# Altium schematic sheet HTBLEBMSALLPro1_4G&AB_Sch_V0.1_260316.SchDoc
size A3; SheetNumber: 2; SheetTotal: 2
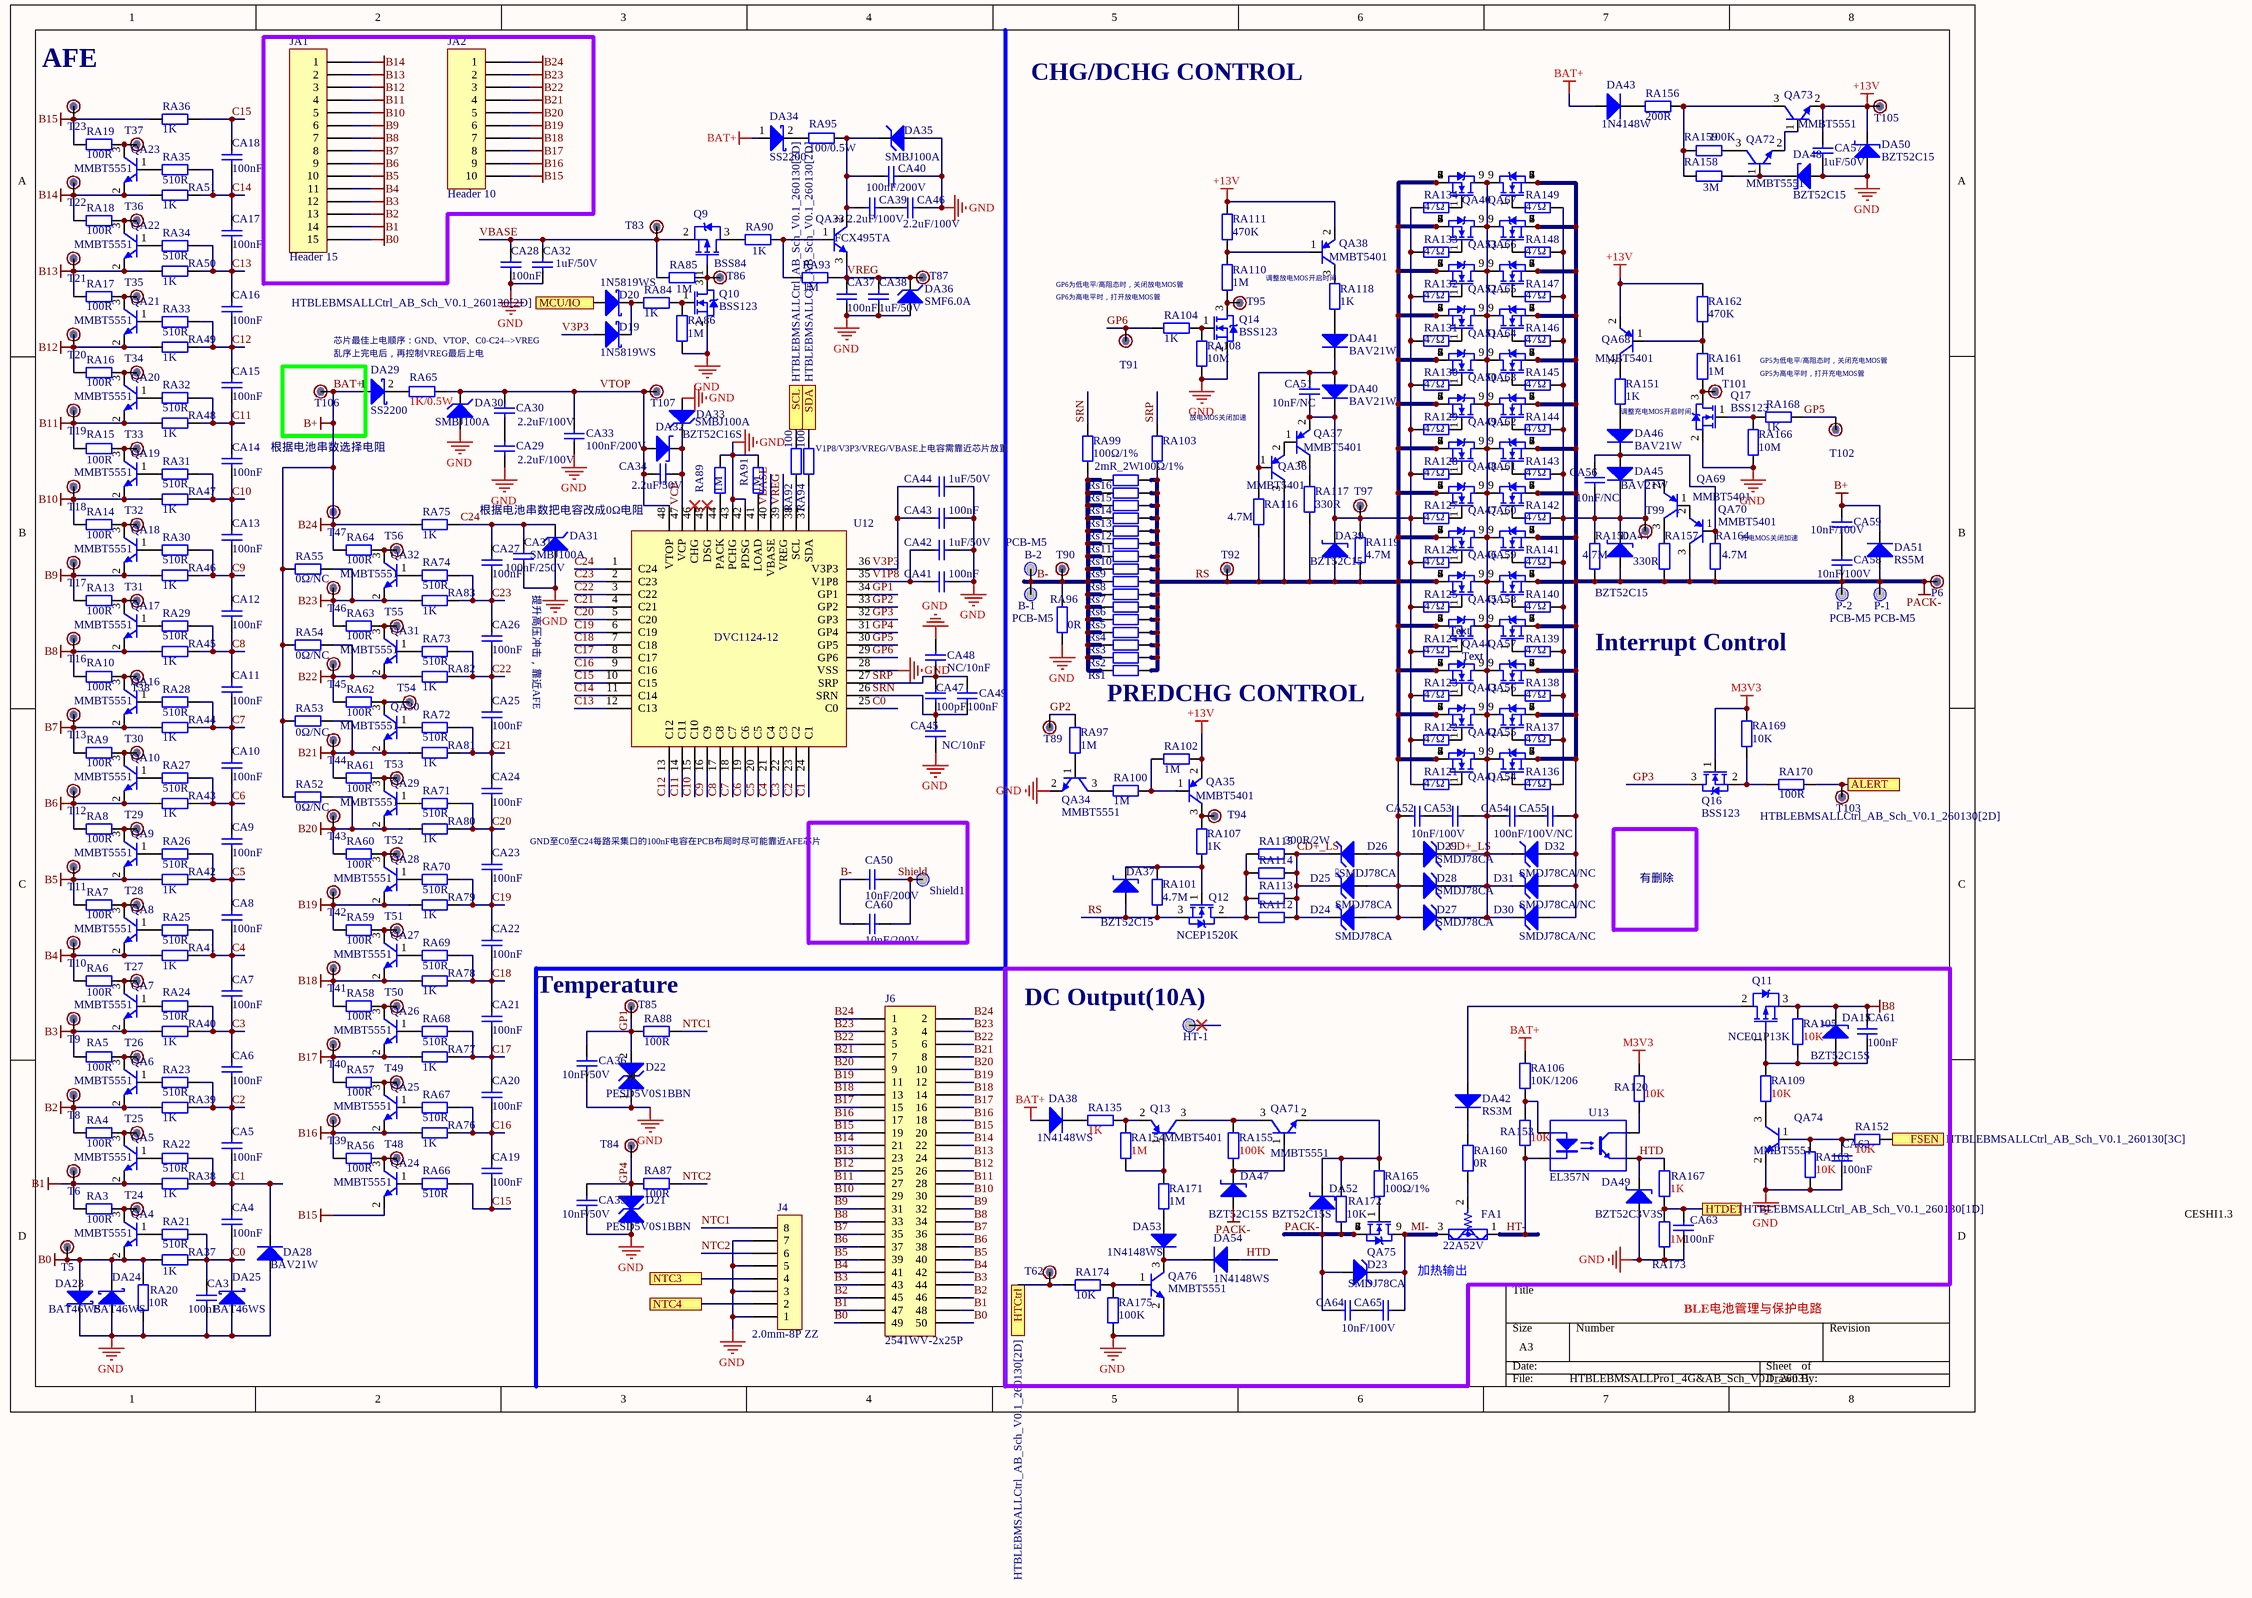
[diagram p0: HTBLEBMSALLPro1_4G&AB_Sch_V0.1_260316.SchDoc]

## Parts
B-1  PCB-M5  [PCB-177M5]
B-2  PCB-M5  [PCB-177M5]
CA3  100nF  [C0603]
CA4  100nF  [C0603]
CA5  100nF  [C0603]
CA6  100nF  [C0603]
CA7  100nF  [C0603]
CA8  100nF  [C0603]
CA9  100nF  [C0603]
CA10  100nF  [C0603]
CA11  100nF  [C0603]
CA12  100nF  [C0603]
CA13  100nF  [C0603]
CA14  100nF  [C0603]
CA15  100nF  [C0603]
CA16  100nF  [C0603]
CA17  100nF  [C0603]
CA18  100nF  [C0603]
CA19  100nF  [C0603]
CA20  100nF  [C0603]
CA21  100nF  [C0603]
CA22  100nF  [C0603]
CA23  100nF  [C0603]
CA24  100nF  [C0603]
CA25  100nF  [C0603]
CA26  100nF  [C0603]
CA27  100nF  [C0603]
CA28  100nF  [C0603]
CA29  2.2uF/100V  [C1206]
CA30  2.2uF/100V  [C1206]
CA31  100nF/250V  [C1206]
CA32  1uF/50V  [C0603]
CA33  100nF/200V  [C0805]
CA34  2.2uF/50V  [C0805]
CA35  10nF/50V  [C0603]
CA36  10nF/50V  [C0603]
CA37  100nF  [C0603]
CA38  1uF/50V  [C0603]
CA39  2.2uF/100V  [C1206]
CA40  100nF/200V  [C0805]
CA41  100nF  [C0603]
CA42  1uF/50V  [C0603]
CA43  100nF  [C0603]
CA44  1uF/50V  [C0603]
CA45  NC/10nF  [C0603]
CA46  2.2uF/100V  [C1206]
CA47  100pF  [C0603]
CA48  NC/10nF  [C0603]
CA49  100nF  [C0603]
CA50  10nF/200V  [C0805]
CA51  10nF/NC  [C0603]
CA52  10nF/100V  [C0805]
CA53  10nF/100V  [C0805]  (value not drawn)
CA54  100nF/100V/NC  [C0805]
CA55  100nF/100V/NC  [C0805]  (value not drawn)
CA56  10nF/NC  [C0603]
CA57  1uF/50V  [C0603]
CA58  10nF/100V  [C1206]
CA59  10nF/100V  [C1206]
CA60  10nF/200V  [C0805]
CA61  100nF  [C0603]
CA62  100nF  [C0603]
CA63  100nF  [C0603]
CA64  10nF/100V  [C0805]
CA65  10nF/100V  [C0805]  (value not drawn)
D19  1N5819WS  [SOD-323]
D20  1N5819WS  [SOD-323]
D21  PESD5V0S1BBN  [SOD-523]
D22  PESD5V0S1BBN  [SOD-523]
D23  SMDJ78CA  [SMC/DO-214AB]
D24  SMDJ78CA  [SMC/DO-214AB]
D25  SMDJ78CA  [SMC/DO-214AB]
D26  SMDJ78CA  [SMC/DO-214AB]
D27  SMDJ78CA  [SMC/DO-214AB]
D28  SMDJ78CA  [SMC/DO-214AB]
D29  SMDJ78CA  [SMC/DO-214AB]
D30  SMDJ78CA/NC  [SMC/DO-214AB]
D31  SMDJ78CA/NC  [SMC/DO-214AB]
D32  SMDJ78CA/NC  [SMC/DO-214AB]
DA15  BZT52C15S  [SOD-323]
DA23  BAT46WS  [SOD-323]
DA24  BAT46WS  [SOD-323]
DA25  BAT46WS  [SOD-323]
DA28  BAV21W  [SOD-123]
DA29  SS2200  [SMA/DO-214AC]
DA30  SMBJ100A  [SMB/DO-214AA]
DA31  SMBJ100A  [SMB/DO-214AA]
DA32  BZT52C16S  [SOD-323]
DA33  SMBJ100A  [SMB/DO-214AA]
DA34  SS2200  [SMA/DO-214AC]
DA35  SMBJ100A  [SMB/DO-214AA]
DA36  SMF6.0A  [SOD-123]
DA37  BZT52C15  [SOD-123]
DA38  1N4148WS  [SOD-323]
DA39  BZT52C15  [SOD-123]
DA40  BAV21W  [SOD-123]
DA41  BAV21W  [SOD-123]
DA42  RS3M  [SMB/DO-214AA]
DA43  1N4148W  [SOD-123]
DA44  BZT52C15  [SOD-123]
DA45  BAV21W  [SOD-123]
DA46  BAV21W  [SOD-123]
DA47  BZT52C15S  [SOD-323]
DA48  BZT52C15  [SOD-123]
DA49  BZT52C3V3S  [SOD-323]
DA50  BZT52C15  [SOD-123]
DA51  RS5M  [SMB/DO-214AA]
DA52  BZT52C15S  [SOD-323]
DA53  1N4148WS  [SOD-323]
DA54  1N4148WS  [SOD-323]
FA1  22A52V  [22A52V]
HT-1  PCB-1004  [BAT+]  (value not drawn)
J4  2.0mm-8P ZZ  [PH2.0-WI-8P]
J6  2541WV-2x25P  [CON-TH_2X21P-P2.00-V-F-R2]
JA1  Header 15  [PH2.0-WI-15P]
JA2  Header 10  [PH2.0-WI-10P]
P6  copper  [COPPER1]  (value not drawn)
P-1  PCB-M5  [PCB-177M5]
P-2  PCB-M5  [PCB-177M5]
Q9  BSS84  [SOT23]
Q10  BSS123  [SOT23]
Q11  NCE01P13K  [TO-252]
Q12  NCEP1520K  [TO-252]
Q13  MMBT5401  [SOT23]
Q14  BSS123  [SOT23]
Q16  BSS123  [SOT23]
Q17  BSS123  [SOT23]
QA4  MMBT5551  [SOT23]
QA5  MMBT5551  [SOT23]
QA6  MMBT5551  [SOT23]
QA7  MMBT5551  [SOT23]
QA8  MMBT5551  [SOT23]
QA9  MMBT5551  [SOT23]
QA10  MMBT5551  [SOT23]
QA16  MMBT5551  [SOT23]
QA17  MMBT5551  [SOT23]
QA18  MMBT5551  [SOT23]
QA19  MMBT5551  [SOT23]
QA20  MMBT5551  [SOT23]
QA21  MMBT5551  [SOT23]
QA22  MMBT5551  [SOT23]
QA23  MMBT5551  [SOT23]
QA24  MMBT5551  [SOT23]
QA25  MMBT5551  [SOT23]
QA26  MMBT5551  [SOT23]
QA27  MMBT5551  [SOT23]
QA28  MMBT5551  [SOT23]
QA29  MMBT5551  [SOT23]
QA30  MMBT5551  [SOT23]
QA31  MMBT5551  [SOT23]
QA32  MMBT5551  [SOT23]
QA33  FCX495TA  [SOT89]
QA34  MMBT5551  [SOT23]
QA35  MMBT5401  [SOT23]
QA36  MMBT5401  [SOT23]
QA37  MMBT5401  [SOT23]
QA38  MMBT5401  [SOT23]
QA40  LR038N15S10  [TOLL-8_L10.4-W9.9-P1.20-LS11.7-BL]  (value not drawn)
QA41  LR038N15S10  [TOLL-8_L10.4-W9.9-P1.20-LS11.7-BL]  (value not drawn)
QA42  LR038N15S10  [TOLL-8_L10.4-W9.9-P1.20-LS11.7-BL]  (value not drawn)
QA43  LR038N15S10  [TOLL-8_L10.4-W9.9-P1.20-LS11.7-BL]  (value not drawn)
QA44  LR038N15S10  [TOLL-8_L10.4-W9.9-P1.20-LS11.7-BL]  (value not drawn)
QA45  LR038N15S10  [TOLL-8_L10.4-W9.9-P1.20-LS11.7-BL]  (value not drawn)
QA46  LR038N15S10  [TOLL-8_L10.4-W9.9-P1.20-LS11.7-BL]  (value not drawn)
QA47  LR038N15S10  [TOLL-8_L10.4-W9.9-P1.20-LS11.7-BL]  (value not drawn)
QA48  LR038N15S10  [TOLL-8_L10.4-W9.9-P1.20-LS11.7-BL]  (value not drawn)
QA49  LR038N15S10  [TOLL-8_L10.4-W9.9-P1.20-LS11.7-BL]  (value not drawn)
QA50  LR038N15S10  [TOLL-8_L10.4-W9.9-P1.20-LS11.7-BL]  (value not drawn)
QA51  LR038N15S10  [TOLL-8_L10.4-W9.9-P1.20-LS11.7-BL]  (value not drawn)
QA52  LR038N15S10  [TOLL-8_L10.4-W9.9-P1.20-LS11.7-BL]  (value not drawn)
QA53  LR038N15S10  [TOLL-8_L10.4-W9.9-P1.20-LS11.7-BL]  (value not drawn)
QA54  LR038N15S10  [TOLL-8_L10.4-W9.9-P1.20-LS11.7-BL]  (value not drawn)
QA55  LR038N15S10  [TOLL-8_L10.4-W9.9-P1.20-LS11.7-BL]  (value not drawn)
QA56  LR038N15S10  [TOLL-8_L10.4-W9.9-P1.20-LS11.7-BL]  (value not drawn)
QA57  LR038N15S10  [TOLL-8_L10.4-W9.9-P1.20-LS11.7-BL]  (value not drawn)
QA58  LR038N15S10  [TOLL-8_L10.4-W9.9-P1.20-LS11.7-BL]  (value not drawn)
QA59  LR038N15S10  [TOLL-8_L10.4-W9.9-P1.20-LS11.7-BL]  (value not drawn)
QA60  LR038N15S10  [TOLL-8_L10.4-W9.9-P1.20-LS11.7-BL]  (value not drawn)
QA61  LR038N15S10  [TOLL-8_L10.4-W9.9-P1.20-LS11.7-BL]  (value not drawn)
QA62  LR038N15S10  [TOLL-8_L10.4-W9.9-P1.20-LS11.7-BL]  (value not drawn)
QA63  LR038N15S10  [TOLL-8_L10.4-W9.9-P1.20-LS11.7-BL]  (value not drawn)
QA64  LR038N15S10  [TOLL-8_L10.4-W9.9-P1.20-LS11.7-BL]  (value not drawn)
QA65  LR038N15S10  [TOLL-8_L10.4-W9.9-P1.20-LS11.7-BL]  (value not drawn)
QA66  LR038N15S10  [TOLL-8_L10.4-W9.9-P1.20-LS11.7-BL]  (value not drawn)
QA67  LR038N15S10  [TOLL-8_L10.4-W9.9-P1.20-LS11.7-BL]  (value not drawn)
QA68  MMBT5401  [SOT23]
QA69  MMBT5401  [SOT23]
QA70  MMBT5401  [SOT23]
QA71  MMBT5551  [SOT23]
QA72  MMBT5551  [SOT23]
QA73  MMBT5551  [SOT23]
QA74  MMBT5551  [SOT23]
QA75  KCX017N10N  [TOLL-8_L10.4-W9.9-P1.20-LS11.7-BL]  (value not drawn)
QA76  MMBT5551  [SOT23]
RA3  100R  [1206]
RA4  100R  [1206]
RA5  100R  [1206]
RA6  100R  [1206]
RA7  100R  [1206]
RA8  100R  [1206]
RA9  100R  [1206]
RA10  100R  [1206]
RA13  100R  [1206]
RA14  100R  [1206]
RA15  100R  [1206]
RA16  100R  [1206]
RA17  100R  [1206]
RA18  100R  [1206]
RA19  100R  [1206]
RA20  10R  [1206]
RA21  510R  [0603]
RA22  510R  [0603]
RA23  510R  [0603]
RA24  510R  [0603]
RA25  510R  [0603]
RA26  510R  [0603]
RA27  510R  [0603]
RA28  510R  [0603]
RA29  510R  [0603]
RA30  510R  [0603]
RA31  510R  [0603]
RA32  510R  [0603]
RA33  510R  [0603]
RA34  510R  [0603]
RA35  510R  [0603]
RA36  1K  [0603]
RA37  1K  [0603]
RA38  1K  [0603]
RA39  1K  [0603]
RA40  1K  [0603]
RA41  1K  [0603]
RA42  1K  [0603]
RA43  1K  [0603]
RA44  1K  [0603]
RA45  1K  [0603]
RA46  1K  [0603]
RA47  1K  [0603]
RA48  1K  [0603]
RA49  1K  [0603]
RA50  1K  [0603]
RA51  1K  [0603]
RA52  0Ω/NC  [0805]
RA53  0Ω/NC  [0805]
RA54  0Ω/NC  [0805]
RA55  0Ω/NC  [0805]
RA56  100R  [1206]
RA57  100R  [1206]
RA58  100R  [1206]
RA59  100R  [1206]
RA60  100R  [1206]
RA61  100R  [1206]
RA62  100R  [1206]
RA63  100R  [1206]
RA64  100R  [1206]
RA65  1K/0.5W  [1210R]
RA66  510R  [0603]
RA67  510R  [0603]
RA68  510R  [0603]
RA69  510R  [0603]
RA70  510R  [0603]
RA71  510R  [0603]
RA72  510R  [0603]
RA73  510R  [0603]
RA74  510R  [0603]
RA75  1K  [0603]
RA76  1K  [0603]
RA77  1K  [0603]
RA78  1K  [0603]
RA79  1K  [0603]
RA80  1K  [0603]
RA81  1K  [0603]
RA82  1K  [0603]
RA83  1K  [0603]
RA84  1K  [0603]
RA85  1M  [0603]
RA86  1M  [0603]
RA87  100R  [0603]
RA88  100R  [0603]
RA89  1M  [0603]
RA90  1K  [0603]
RA91  1M  [0603]
RA92  100  [0603]
RA93  1M  [0603]
RA94  100  [0603]
RA95  100/0.5W  [1210R]
RA96  0R  [1206]
RA97  1M  [0603]
RA99  100Ω/1%  [0603]
RA100  1M  [0603]
RA101  4.7M  [0603]
RA102  1M  [0603]
RA103  100Ω/1%  [0603]
RA104  1K  [0603]
RA105  10K  [0603]
RA106  10K/1206  [1206]
RA107  1K  [0603]
RA108  10M  [0603]
RA109  10K  [0603]
RA110  1M  [0603]
RA111  470K  [0603]
RA112  300R/2W  [2512]  (value not drawn)
RA113  300R/2W  [2512]  (value not drawn)
RA114  300R/2W  [2512]  (value not drawn)
RA115  300R/2W  [2512]
RA116  4.7M  [0603]
RA117  330R  [0603]
RA118  1K  [0603]
RA119  4.7M  [0603]
RA120  10K  [0603]
RA121  47Ω  [0603]
RA122  47Ω  [0603]
RA123  47Ω  [0603]
RA124  47Ω  [0603]
RA125  47Ω  [0603]
RA126  47Ω  [0603]
RA127  47Ω  [0603]
RA128  47Ω  [0603]
RA129  47Ω  [0603]
RA130  47Ω  [0603]
RA131  47Ω  [0603]
RA132  47Ω  [0603]
RA133  47Ω  [0603]
RA134  47Ω  [0603]
RA135  1K  [0603]
RA136  47Ω  [0603]
RA137  47Ω  [0603]
RA138  47Ω  [0603]
RA139  47Ω  [0603]
RA140  47Ω  [0603]
RA141  47Ω  [0603]
RA142  47Ω  [0603]
RA143  47Ω  [0603]
RA144  47Ω  [0603]
RA145  47Ω  [0603]
RA146  47Ω  [0603]
RA147  47Ω  [0603]
RA148  47Ω  [0603]
RA149  47Ω  [0603]
RA150  4.7M  [0603]
RA151  1K  [0603]
RA152  10K  [0603]
RA153  10K  [0603]
RA154  1M  [0603]
RA155  100K  [0603]
RA156  200R  [0805]
RA157  330R  [0603]
RA158  3M  [0603]
RA159  100K  [0603]
RA160  0R  [1206]
RA161  1M  [0603]
RA162  470K  [0603]
RA163  10K  [0603]
RA164  4.7M  [0603]
RA165  100Ω/1%  [0603]
RA166  10M  [0603]
RA167  1K  [0603]
RA168  1K  [0603]
RA169  10K  [0603]
RA170  100R  [0603]
RA171  1M  [0603]
RA172  10K  [0603]
RA173  1M  [0603]
RA174  10K  [0603]
RA175  100K  [0603]
Rs1  2mR_2W  [2512]  (value not drawn)
Rs2  2mR_2W  [2512]  (value not drawn)
Rs3  2mR_2W  [2512]  (value not drawn)
Rs4  2mOhm_1%_2W  [2512]  (value not drawn)
Rs5  2mOhm_1%_2W  [2512]  (value not drawn)
Rs6  2mOhm_1%_2W  [2512]  (value not drawn)
Rs7  2mOhm_1%_2W  [2512]  (value not drawn)
Rs8  2mR_2W  [2512]  (value not drawn)
Rs9  2mR_2W  [2512]  (value not drawn)
Rs10  2mR_2W  [2512]  (value not drawn)
Rs11  2mR_2W  [2512]  (value not drawn)
Rs12  2mOhm_1%_2W  [2512]  (value not drawn)
Rs13  2mOhm_1%_2W  [2512]  (value not drawn)
Rs14  2mOhm_1%_2W  [2512]  (value not drawn)
Rs15  2mOhm_1%_2W  [2512]  (value not drawn)
Rs16  2mR_2W  [2512]
Shield1  PCB-1004  [BAT+]  (value not drawn)
T5  B0  [PT_STM]  (value not drawn)
T6  B0  [PT_STM]  (value not drawn)
T8  Test  [PT_STM]  (value not drawn)
T9  Test  [PT_STM]  (value not drawn)
T10  Test  [PT_STM]  (value not drawn)
T11  Test  [PT_STM]  (value not drawn)
T12  B5  [PT_STM]  (value not drawn)
T13  Test  [PT_STM]  (value not drawn)
T16  Test  [PT_STM]  (value not drawn)
T17  Test  [PT_STM]  (value not drawn)
T18  Test  [PT_STM]  (value not drawn)
T19  B10  [PT_STM]  (value not drawn)
T20  Test  [PT_STM]  (value not drawn)
T21  Test  [PT_STM]  (value not drawn)
T22  Test  [PT_STM]  (value not drawn)
T23  Test  [PT_STM]  (value not drawn)
T24  Test  [PT_STM]  (value not drawn)
T25  Test  [PT_STM]  (value not drawn)
T26  Test  [PT_STM]  (value not drawn)
T27  Test  [PT_STM]  (value not drawn)
T28  Test  [PT_STM]  (value not drawn)
T29  Test  [PT_STM]  (value not drawn)
T30  Test  [PT_STM]  (value not drawn)
T31  Test  [PT_STM]  (value not drawn)
T32  Test  [PT_STM]  (value not drawn)
T33  Test  [PT_STM]  (value not drawn)
T34  Test  [PT_STM]  (value not drawn)
T35  Test  [PT_STM]  (value not drawn)
T36  Test  [PT_STM]  (value not drawn)
T37  Test  [PT_STM]  (value not drawn)
T38  Test  [PT_STM]  (value not drawn)
T39  Test  [PT_STM]  (value not drawn)
T40  Test  [PT_STM]  (value not drawn)
T41  Test  [PT_STM]  (value not drawn)
T42  Test  [PT_STM]  (value not drawn)
T43  Test  [PT_STM]  (value not drawn)
T44  Test  [PT_STM]  (value not drawn)
T45  Test  [PT_STM]  (value not drawn)
T46  Test  [PT_STM]  (value not drawn)
T47  Test  [PT_STM]  (value not drawn)
T48  Test  [PT_STM]  (value not drawn)
T49  Test  [PT_STM]  (value not drawn)
T50  Test  [PT_STM]  (value not drawn)
T51  Test  [PT_STM]  (value not drawn)
T52  Test  [PT_STM]  (value not drawn)
T53  Test  [PT_STM]  (value not drawn)
T54  Test  [PT_STM]  (value not drawn)
T55  Test  [PT_STM]  (value not drawn)
T56  Test  [PT_STM]  (value not drawn)
T62  M5  [PT_STM]  (value not drawn)
T83  M5  [PT_STM]  (value not drawn)
T84  M5  [PT_STM]  (value not drawn)
T85  M5  [PT_STM]  (value not drawn)
T86  M5  [PT_STM]  (value not drawn)
T87  M5  [PT_STM]  (value not drawn)
T89  M5  [PT_STM]  (value not drawn)
T90  M5  [PT_STM]  (value not drawn)
T91  M5  [PT_STM]  (value not drawn)
T92  M5  [PT_STM]  (value not drawn)
T94  M5  [PT_STM]  (value not drawn)
T95  M5  [PT_STM]  (value not drawn)
T97  M5  [PT_STM]  (value not drawn)
T99  M5  [PT_STM]  (value not drawn)
T101  M5  [PT_STM]  (value not drawn)
T102  M5  [PT_STM]  (value not drawn)
T103  M5  [PT_STM]  (value not drawn)
T105  M5  [PT_STM]  (value not drawn)
T106  M5  [PT_STM]  (value not drawn)
T107  M5  [PT_STM]  (value not drawn)
U12  DVC1124-12  [LQFP48(0.5mm)]
U13  EL357N  [EL357N]

## Blocks framed on the sheet
乱序上完电后，再控制VREG最后上电: T106
DC Output(10A): CA61-CA65 D23 DA15 DA38 DA42 DA47 DA49 DA52-DA54 FA1 HT-1 Q11 Q13 QA71 QA74-QA76 RA105 RA106 RA109 RA120 RA135 RA152-RA155 RA160 RA163 RA165 RA167 RA171-RA175 T62 U13

## Ports
ALERT (see HTBLEBMSALLCtrl_AB_Sch_V0.1_260130[2D]), FSEN (see HTBLEBMSALLCtrl_AB_Sch_V0.1_260130[3C]), HTCtrl (see HTBLEBMSALLCtrl_AB_Sch_V0.1_260130[2D]), HTDET (see HTBLEBMSALLCtrl_AB_Sch_V0.1_260130[1D]), MCU/IO (see HTBLEBMSALLCtrl_AB_Sch_V0.1_260130[2D]), NTC3 (see HTBLEBMSALLCtrl_AB_Sch_V0.1_260130[6D]), NTC4 (see HTBLEBMSALLCtrl_AB_Sch_V0.1_260130[7D]), SCL (see HTBLEBMSALLCtrl_AB_Sch_V0.1_260130[2D]), SDA (see HTBLEBMSALLCtrl_AB_Sch_V0.1_260130[2D])

## Nets
+13V: CA57.1 DA50.2(K) QA35.2(E) QA38.2(E) QA68.2(E) QA73.2(E) RA102.2 RA111.2 RA162.2 T105.1
B0: DA23.1(A) DA24.2(K) J6.49 J6.50 JA1.15 QA4.2(E) RA20.1 RA37.1 T5.1
B1: J6.47 J6.48 JA1.14 QA5.2(E) RA3.1 RA38.1 T6.1
B2: J6.45 J6.46 JA1.13 QA6.2(E) RA4.1 RA39.1 T8.1
B3: J6.43 J6.44 JA1.12 QA7.2(E) RA5.1 RA40.1 T9.1
B4: J6.41 J6.42 JA1.11 QA8.2(E) RA6.1 RA41.1 T10.1
B5: J6.39 J6.40 JA1.10 QA9.2(E) RA7.1 RA42.1 T11.1
B6: J6.37 J6.38 JA1.9 QA10.2(E) RA8.1 RA43.1 T12.1
B7: J6.35 J6.36 JA1.8 QA16.2(E) RA9.1 RA44.1 T13.1
B8: CA61.2 DA15.2(K) J6.33 J6.34 JA1.7 Q11.3(S) QA17.2(E) RA10.1 RA45.1 RA105.1 T16.1
B9: J6.31 J6.32 JA1.6 QA18.2(E) RA13.1 RA46.1 T17.1
B10: J6.29 J6.30 JA1.5 QA19.2(E) RA14.1 RA47.1 T18.1
B11: J6.27 J6.28 JA1.4 QA20.2(E) RA15.1 RA48.1 T19.1
B12: J6.25 J6.26 JA1.3 QA21.2(E) RA16.1 RA49.1 T20.1
B13: J6.23 J6.24 JA1.2 QA22.2(E) RA17.1 RA50.1 T21.1
B14: J6.21 J6.22 JA1.1 QA23.2(E) RA18.1 RA51.1 T22.1
B15: J6.19 J6.20 JA2.10 QA24.2(E) RA19.1 RA36.1 T23.1
B16: J6.17 J6.18 JA2.9 QA25.2(E) RA56.1 RA76.1 T39.1
B17: J6.15 J6.16 JA2.8 QA26.2(E) RA57.1 RA77.1 T40.1
B18: J6.13 J6.14 JA2.7 QA27.2(E) RA58.1 RA78.1 T41.1
B19: J6.11 J6.12 JA2.6 QA28.2(E) RA59.1 RA79.1 T42.1
B20: J6.9 J6.10 JA2.5 QA29.2(E) RA52.2 RA60.1 RA80.1 T43.1
B21: J6.7 J6.8 JA2.4 QA30.2(E) RA53.2 RA61.1 RA81.1 T44.1
B22: J6.5 J6.6 JA2.3 QA31.2(E) RA54.2 RA62.1 RA82.1 T45.1
B23: J6.3 J6.4 JA2.2 QA32.2(E) RA55.2 RA63.1 RA83.1 T46.1
B24: CA59.1 DA29.1(A) DA34.1(A) DA38.1(A) DA43.1(A) DA51.2(K) J6.1 J6.2 JA2.1 RA52.1 RA53.1 RA54.1 RA55.1 RA64.1 RA75.1 RA106.1 T47.1 T106.1  [also labelled B+, BAT+]
GND: CA3.1 CA28.1 CA29.1 CA31.1 CA32.1 CA33.1 CA35.2 CA36.2 CA37.1 CA38.1 CA40.1 CA41.1 CA42.1 CA43.1 CA44.1 CA45.1 CA46.1 CA48.2 CA57.2 CA62.1 CA63.1 D21.1(A) D22.1(A) DA23.2(K) DA24.1(A) DA25.1(A) DA28.1(A) DA30.1(A) DA31.1(A) DA33.1(A) DA35.1(A) DA36.1(A) DA48.1(A) DA49.1(A) DA50.1(A) J4.1 J4.3 J4.5 J4.7 Q10.2(S) Q14.2(S) Q17.2(S) QA34.2(E) QA74.2(E) QA76.2(E) RA20.2 RA86.1 RA89.2 RA91.2 RA96.2 RA108.2 RA163.2 RA166.2 RA173.2 RA175.1 U12.28(VSS) U12.42(PDSG) U12.43(PCHG)
M3V3: Q16.1(G) RA120.1 RA169.2
PACK-: CA55.2 CA58.2 CA64.1 D23.1(A) D30.1(A) D31.1(A) D32.1(A) DA44.1(A) DA47.1(A) DA51.1(A) DA52.1(A) P6.1 P-1.1 P-2.1 QA54.2(S) QA54.3(S) QA54.4(S) QA54.5(S) QA54.6(S) QA54.7(S) QA54.8(S) QA55.2(S) QA55.3(S) QA55.4(S) QA55.5(S) QA55.6(S) QA55.7(S) QA55.8(S) QA56.2(S) QA56.3(S) QA56.4(S) QA56.5(S) QA56.6(S) QA56.7(S) QA56.8(S) QA57.2(S) QA57.3(S) QA57.4(S) QA57.5(S) QA57.6(S) QA57.7(S) QA57.8(S) QA58.2(S) QA58.3(S) QA58.4(S) QA58.5(S) QA58.6(S) QA58.7(S) QA58.8(S) QA59.2(S) QA59.3(S) QA59.4(S) QA59.5(S) QA59.6(S) QA59.7(S) QA59.8(S) QA60.2(S) QA60.3(S) QA60.4(S) QA60.5(S) QA60.6(S) QA60.7(S) QA60.8(S) QA61.2(S) QA61.3(S) QA61.4(S) QA61.5(S) QA61.6(S) QA61.7(S) QA61.8(S) QA62.2(S) QA62.3(S) QA62.4(S) QA62.5(S) QA62.6(S) QA62.7(S) QA62.8(S) QA63.2(S) QA63.3(S) QA63.4(S) QA63.5(S) QA63.6(S) QA63.7(S) QA63.8(S) QA64.2(S) QA64.3(S) QA64.4(S) QA64.5(S) QA64.6(S) QA64.7(S) QA64.8(S) QA65.2(S) QA65.3(S) QA65.4(S) QA65.5(S) QA65.6(S) QA65.7(S) QA65.8(S) QA66.2(S) QA66.3(S) QA66.4(S) QA66.5(S) QA66.6(S) QA66.7(S) QA66.8(S) QA67.2(S) QA67.3(S) QA67.4(S) QA67.5(S) QA67.6(S) QA67.7(S) QA67.8(S) QA70.3(C) QA75.2(S) QA75.3(S) QA75.4(S) QA75.5(S) QA75.6(S) QA75.7(S) QA75.8(S) RA150.2 RA157.2 RA164.2 RA172.1
ALERT: RA170.1 T103.1 ; port ALERT
B-: B-1.1 B-2.1 CA50.2 CA60.2 RA96.1 RA99.1 Rs1.1 Rs2.1 Rs3.1 Rs4.1 Rs5.1 Rs6.1 Rs7.1 Rs8.1 Rs9.1 Rs10.1 Rs11.1 Rs12.1 Rs13.1 Rs14.1 Rs15.1 Rs16.1 T90.1
C0: CA3.2 CA4.1 DA25.2(K) RA21.2 RA37.2 U12.25(C0)
C1: CA4.2 CA5.1 DA28.2(K) RA22.2 RA38.2 U12.24(C1)
C2: CA5.2 CA6.1 RA23.2 RA39.2 U12.23(C2)
C3: CA6.2 CA7.1 RA24.2 RA40.2 U12.22(C3)
C4: CA7.2 CA8.1 RA25.2 RA41.2 U12.21(C4)
C5: CA8.2 CA9.1 RA26.2 RA42.2 U12.20(C5)
C6: CA9.2 CA10.1 RA27.2 RA43.2 U12.19(C6)
C7: CA10.2 CA11.1 RA28.2 RA44.2 U12.18(C7)
C8: CA11.2 CA12.1 RA29.2 RA45.2 U12.17(C8)
C9: CA12.2 CA13.1 RA30.2 RA46.2 U12.16(C9)
C10: CA13.2 CA14.1 RA31.2 RA47.2 U12.15(C10)
C11: CA14.2 CA15.1 RA32.2 RA48.2 U12.14(C11)
C12: CA15.2 CA16.1 RA33.2 RA49.2 U12.13(C12)
C13: CA16.2 CA17.1 RA34.2 RA50.2 U12.12(C13)
C14: CA17.2 CA18.1 RA35.2 RA51.2 U12.11(C14)
C15: CA18.2 CA19.1 RA36.2 RA66.2 U12.10(C15)
C16: CA19.2 CA20.1 RA67.2 RA76.2 U12.9(C16)
C17: CA20.2 CA21.1 RA68.2 RA77.2 U12.8(C17)
C18: CA21.2 CA22.1 RA69.2 RA78.2 U12.7(C18)
C19: CA22.2 CA23.1 RA70.2 RA79.2 U12.6(C19)
C20: CA23.2 CA24.1 RA71.2 RA80.2 U12.5(C20)
C21: CA24.2 CA25.1 RA72.2 RA81.2 U12.4(C21)
C22: CA25.2 CA26.1 RA73.2 RA82.2 U12.3(C22)
C23: CA26.2 CA27.1 RA74.2 RA83.2 U12.2(C23)
C24: CA27.2 CA31.2 DA31.2(K) RA75.2 U12.1(C24)
CD+_LS: CA53.2 CA54.1 D24.2(K) D25.2(K) D26.2(K) D27.2(K) D28.2(K) D29.2(K) D30.2(K) D31.2(K) D32.2(K) QA40.9(D) QA41.9(D) QA42.9(D) QA43.9(D) QA44.9(D) QA45.9(D) QA46.9(D) QA47.9(D) QA48.9(D) QA49.9(D) QA50.9(D) QA51.9(D) QA52.9(D) QA53.9(D) QA54.9(D) QA55.9(D) QA56.9(D) QA57.9(D) QA58.9(D) QA59.9(D) QA60.9(D) QA61.9(D) QA62.9(D) QA63.9(D) QA64.9(D) QA65.9(D) QA66.9(D) QA67.9(D) RA112.1 RA113.1 RA114.1 RA115.1
FSEN: RA152.2 ; port FSEN
GP1: CA36.1 D22.2(K) RA88.1 T85.1 U12.34(GP1)
GP2: RA97.1 T89.1 U12.33(GP2)
GP3: Q16.3(D) U12.32(GP3)
GP4: CA35.1 D21.2(K) RA87.1 T84.1 U12.31(GP4)
GP5: RA168.2 T102.1 U12.30(GP5)
GP6: RA104.1 T91.1 U12.29(GP6)
HT-: FA1.1(T1) RA153.2 U13.2
HTCtrl: RA174.1 T62.1 ; port HTCtrl
HTD: DA49.2(K) DA54.1(A) RA167.1 U13.3
HTDET: CA63.2 RA167.2 RA173.1 ; port HTDET
MCU/IO: D20.1(A) ; port MCU/IO
MI-: CA65.2 D23.2(K) FA1.3(T3) QA75.9(D)
NTC1: J4.8 RA88.2
NTC2: J4.6 RA87.2
NTC3: J4.4 ; port NTC3
NTC4: J4.2 ; port NTC4
RS: CA52.1 D24.1(A) D25.1(A) D26.1(A) D27.1(A) D28.1(A) D29.1(A) DA37.1(A) DA39.1(A) Q12.3(S) QA36.3(C) QA40.2(S) QA40.3(S) QA40.4(S) QA40.5(S) QA40.6(S) QA40.7(S) QA40.8(S) QA41.2(S) QA41.3(S) QA41.4(S) QA41.5(S) QA41.6(S) QA41.7(S) QA41.8(S) QA42.2(S) QA42.3(S) QA42.4(S) QA42.5(S) QA42.6(S) QA42.7(S) QA42.8(S) QA43.2(S) QA43.3(S) QA43.4(S) QA43.5(S) QA43.6(S) QA43.7(S) QA43.8(S) QA44.2(S) QA44.3(S) QA44.4(S) QA44.5(S) QA44.6(S) QA44.7(S) QA44.8(S) QA45.2(S) QA45.3(S) QA45.4(S) QA45.5(S) QA45.6(S) QA45.7(S) QA45.8(S) QA46.2(S) QA46.3(S) QA46.4(S) QA46.5(S) QA46.6(S) QA46.7(S) QA46.8(S) QA47.2(S) QA47.3(S) QA47.4(S) QA47.5(S) QA47.6(S) QA47.7(S) QA47.8(S) QA48.2(S) QA48.3(S) QA48.4(S) QA48.5(S) QA48.6(S) QA48.7(S) QA48.8(S) QA49.2(S) QA49.3(S) QA49.4(S) QA49.5(S) QA49.6(S) QA49.7(S) QA49.8(S) QA50.2(S) QA50.3(S) QA50.4(S) QA50.5(S) QA50.6(S) QA50.7(S) QA50.8(S) QA51.2(S) QA51.3(S) QA51.4(S) QA51.5(S) QA51.6(S) QA51.7(S) QA51.8(S) QA52.2(S) QA52.3(S) QA52.4(S) QA52.5(S) QA52.6(S) QA52.7(S) QA52.8(S) QA53.2(S) QA53.3(S) QA53.4(S) QA53.5(S) QA53.6(S) QA53.7(S) QA53.8(S) RA101.1 RA103.1 RA116.1 RA117.1 RA119.2 Rs1.2 Rs2.2 Rs3.2 Rs4.2 Rs5.2 Rs6.2 Rs7.2 Rs8.2 Rs9.2 Rs10.2 Rs11.2 Rs12.2 Rs13.2 Rs14.2 Rs15.2 Rs16.2 T92.1
SCL: RA92.2 ; port SCL
SDA: RA94.2 ; port SDA
Shield: CA50.1 CA60.1 Shield1.1
SRN: CA45.2 CA47.2 CA49.2 RA99.2 U12.26(SRN)
SRP: CA47.1 CA48.1 CA49.1 RA103.2 U12.27(SRP)
V1P8: CA41.2 CA42.2 U12.35(V1P8)
V3P3: CA43.2 CA44.2 D19.1(A) U12.36(V3P3)
VBASE: CA28.2 CA32.2 Q9.2(S) RA85.1 T83.1 U12.40(VBASE)
VCP: CA34.1 DA32.2(K) DA33.2(K) U12.47(VCP)
VREG: CA37.2 CA38.2 DA36.2(K) QA33.3(E) RA93.2 T87.1 U12.39(VREG)
VTOP: CA30.2 CA33.2 CA34.2 DA30.2(K) DA32.1(A) RA65.2 T107.1 U12.48(VTOP)
NetCA29_2: CA29.2 CA30.1
NetCA39_1: CA39.1 CA46.2
NetCA39_2: CA39.2 CA40.2 DA35.2(K) QA33.2(C) RA95.2
NetCA51_1: CA51.1 DA39.2(K) DA40.2(K) QA37.2(E) RA119.1 RA121.2 RA122.2 RA123.2 RA124.2 RA125.2 RA126.2 RA127.2 RA128.2 RA129.2 RA130.2 RA131.2 RA132.2 RA133.2 RA134.2 T97.1
NetCA51_2: CA51.2 DA40.1(A) DA41.2(K) QA36.1(B) RA116.2
NetCA52_2: CA52.2 CA53.1
NetCA54_2: CA54.2 CA55.1
NetCA56_1: CA56.1 DA44.2(K) DA45.2(K) QA69.2(E) RA136.1 RA137.1 RA138.1 RA139.1 RA140.1 RA141.1 RA142.1 RA143.1 RA144.1 RA145.1 RA146.1 RA147.1 RA148.1 RA149.1 RA150.1 T99.1
NetCA56_2: CA56.2 DA45.1(A) DA46.2(K) QA70.1(B) RA164.1
NetCA58_1: CA58.1 CA59.2
NetCA61_1: CA61.1 DA15.1(A) Q11.1(G) RA105.2 RA109.1
NetCA62_2: CA62.2 QA74.1(B) RA152.1 RA163.1
NetCA64_2: CA64.2 CA65.1
NetD19_2: D19.2(K) D20.2(K) RA84.2
NetDA29_2: DA29.2(K) RA65.1
NetDA34_2: DA34.2(K) RA95.1
NetDA37_2: DA37.2(K) Q12.1(G) RA101.2 RA107.1
NetDA38_2: DA38.2(K) RA135.2
NetDA41_1: DA41.1(A) RA118.1
NetDA42_1: DA42.1(A) Q11.2(D)
NetDA42_2: DA42.2(K) RA160.1
NetDA43_2: DA43.2(K) RA156.2
NetDA46_1: DA46.1(A) RA151.1
NetDA47_2: DA47.2(K) QA71.1(B) RA155.2
NetDA48_2: DA48.2(K) QA72.1(B) RA158.1
NetDA52_2: DA52.2(K) QA71.2(E) RA165.1 RA172.2
NetDA53_1: DA53.1(A) RA171.1
NetDA53_2: DA53.2(K) DA54.2(K) QA76.3(C)
NetFA1_2: FA1.2(T2) RA160.2
NetQ9_1: Q9.1(G) Q10.3(D) RA85.2 T86.1
NetQ9_3: Q9.3(D) RA90.1
NetQ10_1: Q10.1(G) RA84.1 RA86.2
NetQ12_2: Q12.2(D) RA112.2 RA113.2 RA114.2 RA115.2
NetQ13_1: Q13.1(B) RA154.2 RA171.2
NetQ13_2: Q13.2(E) RA135.1 RA154.1
NetQ13_3: Q13.3(C) QA71.3(C) RA155.1
NetQ14_1: Q14.1(G) RA104.2 RA108.1
NetQ14_3: Q14.3(D) RA110.1 T95.1
NetQ16_2: Q16.2(S) RA169.1 RA170.2
NetQ17_1: Q17.1(G) RA166.1 RA168.1
NetQ17_3: Q17.3(D) RA161.1 T101.1
NetQA4_1: QA4.1(B) RA21.1
NetQA4_3: QA4.3(C) RA3.2 T24.1
NetQA5_1: QA5.1(B) RA22.1
NetQA5_3: QA5.3(C) RA4.2 T25.1
NetQA6_1: QA6.1(B) RA23.1
NetQA6_3: QA6.3(C) RA5.2 T26.1
NetQA7_1: QA7.1(B) RA24.1
NetQA7_3: QA7.3(C) RA6.2 T27.1
NetQA8_1: QA8.1(B) RA25.1
NetQA8_3: QA8.3(C) RA7.2 T28.1
NetQA9_1: QA9.1(B) RA26.1
NetQA9_3: QA9.3(C) RA8.2 T29.1
NetQA10_1: QA10.1(B) RA27.1
NetQA10_3: QA10.3(C) RA9.2 T30.1
NetQA16_1: QA16.1(B) RA28.1
NetQA16_3: QA16.3(C) RA10.2 T38.1
NetQA17_1: QA17.1(B) RA29.1
NetQA17_3: QA17.3(C) RA13.2 T31.1
NetQA18_1: QA18.1(B) RA30.1
NetQA18_3: QA18.3(C) RA14.2 T32.1
NetQA19_1: QA19.1(B) RA31.1
NetQA19_3: QA19.3(C) RA15.2 T33.1
NetQA20_1: QA20.1(B) RA32.1
NetQA20_3: QA20.3(C) RA16.2 T34.1
NetQA21_1: QA21.1(B) RA33.1
NetQA21_3: QA21.3(C) RA17.2 T35.1
NetQA22_1: QA22.1(B) RA34.1
NetQA22_3: QA22.3(C) RA18.2 T36.1
NetQA23_1: QA23.1(B) RA35.1
NetQA23_3: QA23.3(C) RA19.2 T37.1
NetQA24_1: QA24.1(B) RA66.1
NetQA24_3: QA24.3(C) RA56.2 T48.1
NetQA25_1: QA25.1(B) RA67.1
NetQA25_3: QA25.3(C) RA57.2 T49.1
NetQA26_1: QA26.1(B) RA68.1
NetQA26_3: QA26.3(C) RA58.2 T50.1
NetQA27_1: QA27.1(B) RA69.1
NetQA27_3: QA27.3(C) RA59.2 T51.1
NetQA28_1: QA28.1(B) RA70.1
NetQA28_3: QA28.3(C) RA60.2 T52.1
NetQA29_1: QA29.1(B) RA71.1
NetQA29_3: QA29.3(C) RA61.2 T53.1
NetQA30_1: QA30.1(B) RA72.1
NetQA30_3: QA30.3(C) RA62.2 T54.1
NetQA31_1: QA31.1(B) RA73.1
NetQA31_3: QA31.3(C) RA63.2 T55.1
NetQA32_1: QA32.1(B) RA74.1
NetQA32_3: QA32.3(C) RA64.2 T56.1
NetQA33_1: QA33.1(B) RA90.2 RA93.1
NetQA34_1: QA34.1(B) RA97.2
NetQA34_3: QA34.3(C) RA100.1
NetQA35_1: QA35.1(B) RA100.2 RA102.1
NetQA35_3: QA35.3(C) RA107.2 T94.1
NetQA36_2: QA36.2(E) QA37.1(B)
NetQA37_3: QA37.3(C) RA117.2
NetQA38_1: QA38.1(B) RA110.2 RA111.1
NetQA38_3: QA38.3(C) RA118.2
NetQA40_1: QA40.1(G) RA134.1
NetQA41_1: QA41.1(G) RA121.1
NetQA42_1: QA42.1(G) RA122.1
NetQA43_1: QA43.1(G) RA123.1
NetQA44_1: QA44.1(G) RA124.1
NetQA45_1: QA45.1(G) RA125.1
NetQA46_1: QA46.1(G) RA126.1
NetQA47_1: QA47.1(G) RA127.1
NetQA48_1: QA48.1(G) RA128.1
NetQA49_1: QA49.1(G) RA129.1
NetQA50_1: QA50.1(G) RA130.1
NetQA51_1: QA51.1(G) RA131.1
NetQA52_1: QA52.1(G) RA132.1
NetQA53_1: QA53.1(G) RA133.1
NetQA54_1: QA54.1(G) RA136.2
NetQA55_1: QA55.1(G) RA137.2
NetQA56_1: QA56.1(G) RA138.2
NetQA57_1: QA57.1(G) RA139.2
NetQA58_1: QA58.1(G) RA140.2
NetQA59_1: QA59.1(G) RA141.2
NetQA60_1: QA60.1(G) RA142.2
NetQA61_1: QA61.1(G) RA143.2
NetQA62_1: QA62.1(G) RA144.2
NetQA63_1: QA63.1(G) RA145.2
NetQA64_1: QA64.1(G) RA146.2
NetQA65_1: QA65.1(G) RA147.2
NetQA66_1: QA66.1(G) RA148.2
NetQA67_1: QA67.1(G) RA149.2
NetQA68_1: QA68.1(B) RA161.2 RA162.1
NetQA68_3: QA68.3(C) RA151.2
NetQA69_1: QA69.1(B) QA70.2(E)
NetQA69_3: QA69.3(C) RA157.1
NetQA72_2: QA72.2(E) QA73.1(B)
NetQA72_3: QA72.3(C) RA159.1
NetQA73_3: QA73.3(C) RA156.1 RA158.2 RA159.2
NetQA74_3: QA74.3(C) RA109.2
NetQA75_1: QA75.1(G) RA165.2
NetQA76_1: QA76.1(B) RA174.2 RA175.2
NetRA89_1: RA89.1 U12.44(PACK)
NetRA91_1: RA91.1 U12.41(LOAD)
NetRA92_1: RA92.1 U12.38(SCL)
NetRA94_1: RA94.1 U12.37(SDA)
NetRA106_2: RA106.2 RA153.1 U13.1
NetRA120_2: RA120.2 U13.4

Not connected (* = marked no-connect by the designer): HT-1 1*; U12 45(DSG)* 46(CHG)*

## Notes on the sheet
- (near T23) AFE
- CHG/DCHG CONTROL
- GP6为低电平/高阻态时，关闭放电MOS管
- GP6为高电平时，打开放电MOS管
- 调整放电MOS开启时间
- 芯片最佳上电顺序：GND、VTOP、C0-C24-->VREG
- 放电MOS关闭加速
- (near RA151) 调整充电MOS开启时间
- GP5为低电平/高阻态时，关闭充电MOS管
- GP5为高电平时，打开充电MOS管
- 根据电池串数选择电阻
- (near RA94) V1P8/V3P3/VREG/VBASE上电容需靠近芯片放置
- 根据电池串数把电容改成0Ω电阻
- 充电MOS关闭加速
- 提升高压冲击，靠近AFE
- (near QA44) Text
- Text
- Interrupt Control
- (near Rs1) PREDCHG CONTROL
- GND至C0至C24每路采集口的100nF电容在PCB布局时尽可能靠近AFE芯片
- 有删除
- (near T85) Temperature
- CESHI1.3
- 加热输出
- BLE电池管理与保护电路

## Library data of the parts
B-1 B-2 HT-1 P-1 P-2 Shield1 = TP
CA3-CA65 = Cap: Capacitor
D19 D20 DA23-DA25 DA29 DA34 = D Schottky: Schottky Diode, 3Pin
D21 D22 = D TVS: TVS Diode, bidirectional
D23-D32 DA30 DA31 DA33 DA35 DA36 = Diode TVS: Uniderection TVS Diode
DA15 DA32 DA37 DA39 DA44 DA47-DA50 DA52 = D Zener: Zener Diode
DA28 DA38 DA40-DA43 DA45 DA46 DA51 DA53 DA54 = Diode
FA1 = Fuse_SCP_SFK: SFK Series Self Control Protector (SCP); value04: SFK-3030; value01: SFK-0630; value02: SFK-1230; value03: SFK-1830; value05: SFK-4030; value06: SFK-5030; value11: SFK-1245; value12: SFK-1445; value13: SFK-2045; value14: SFK-3045; value15: SFK-4045; value16: SFK-5045; value21: SFK-1260; value22: SFK-1460; value23: SFK-2060; value24: SFK-3060; value25: SFK-4060; value26: SFK-5060
J4 = CON8: 8Pin
J6 = Header 25X2: Header, 25-Pin, Dual row; LatestRevisionDate: 17-Jul-2002; LatestRevisionNote: Re-released for DXP Platform.; Publisher: Altium Limited
JA1 = Header 15: Header, 15-Pin; LatestRevisionDate: 17-Jul-2002; LatestRevisionNote: Re-released for DXP Platform.; Publisher: Altium Limited
JA2 = Header 10: Header, 10-Pin; LatestRevisionDate: 17-Jul-2002; LatestRevisionNote: Re-released for DXP Platform.; Publisher: Altium Limited
P6 T5 T6 T8-T13 T16-T56 T62 T83-T87 T89-T92 T94 T95 T97 T99 T101-T103 T105-T107 = TESTPOINT1
Q9 Q11 = PMOS-2: P-Channel Power MOSFET; Note: Pin 4 not drawn and electrically connected to Pin 2.; Published: 8-Jun-2000; LatestRevisionDate: 17-Jul-2002; LatestRevisionNote: Re-released for DXP Platform.; DatasheetVersion: PD-9.390D; PackageVersion: Feb-1997; PackageReference: TO-220AB; Publisher: Altium Limited; PackageDescription: TO, Thru-Hole, Vertical, Heatsink Mounted; 3 In-Line Leads; Pitch 2.54 mm; ComponentLink1Description: Manufacturer Link; ComponentLink1URL: http://www.irf.com/
Q10 Q12 Q14 Q16 Q17 = NMOS: NMOSFET
Q13 = 2N3906: PNP General Purpose Amplifier; Published: 8-Jun-2000; LatestRevisionDate: 15-Jan-2003; LatestRevisionNote: PCB Footprint 'BCY-W3/D4.7' replaced; DatasheetVersion: 1997; PackageVersion: Sep-1998; PackageReference: TO-92A; Publisher: Altium Limited; PackageDescription: TO, Flat Index; 3 In-Line, Axial Leads; Body Dia. 4.5mm; Leads 0.51 x 0.48 mm (max); ComponentLink1Description: Manufacturer Link; ComponentLink1URL: http://www.fairchildsemi.com/; ComponentLink2Description: Datasheet; ComponentLink2URL: http://www.fairchildsemi.com/ds/2N%2F2N3906.pdf
QA4-QA10 QA16-QA34 QA71-QA74 QA76 = S8050LT1: NPN Transistor
QA35-QA38 QA68-QA70 = S8550LT1: PNP Transistor
QA40-QA67 QA75 = NMOS_TOLL: NMOSFET
RA3-RA10 RA13-RA97 RA99-RA175 Rs1-Rs16 = Res2: Resistor
U13 = TLP521-1